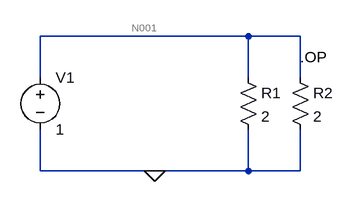
[diagram p0: schematic VSource_paraR.asc]
VSource_paraR.asc, the LTspice schematic file:
Version 4
SHEET 1 880 680
WIRE 416 224 96 224
WIRE 496 224 416 224
WIRE 96 288 96 224
WIRE 416 288 416 224
WIRE 496 288 496 224
WIRE 96 432 96 368
WIRE 272 432 96 432
WIRE 416 432 416 368
WIRE 416 432 272 432
WIRE 496 432 496 368
WIRE 496 432 416 432
FLAG 272 432 0
SYMBOL voltage 96 272 R0
SYMATTR InstName V1
SYMATTR Value 1
SYMBOL res 400 272 R0
SYMATTR InstName R1
SYMATTR Value 2
SYMBOL res 480 272 R0
SYMATTR InstName R2
SYMATTR Value 2
TEXT 496 256 Left 2 !.OP

The netlist it stands for:
* VSource_paraR.asc
V1 N001 0 1
R1 N001 0 2
R2 N001 0 2
.OP
.backanno
.end

* Results of the author's LTspice run, read from the files saved beside the schematic
* Operating Point:
*   V(n001) = 1 V
*   I(R2) = 500 mA
*   I(R1) = 500 mA
*   I(V1) = -1 A